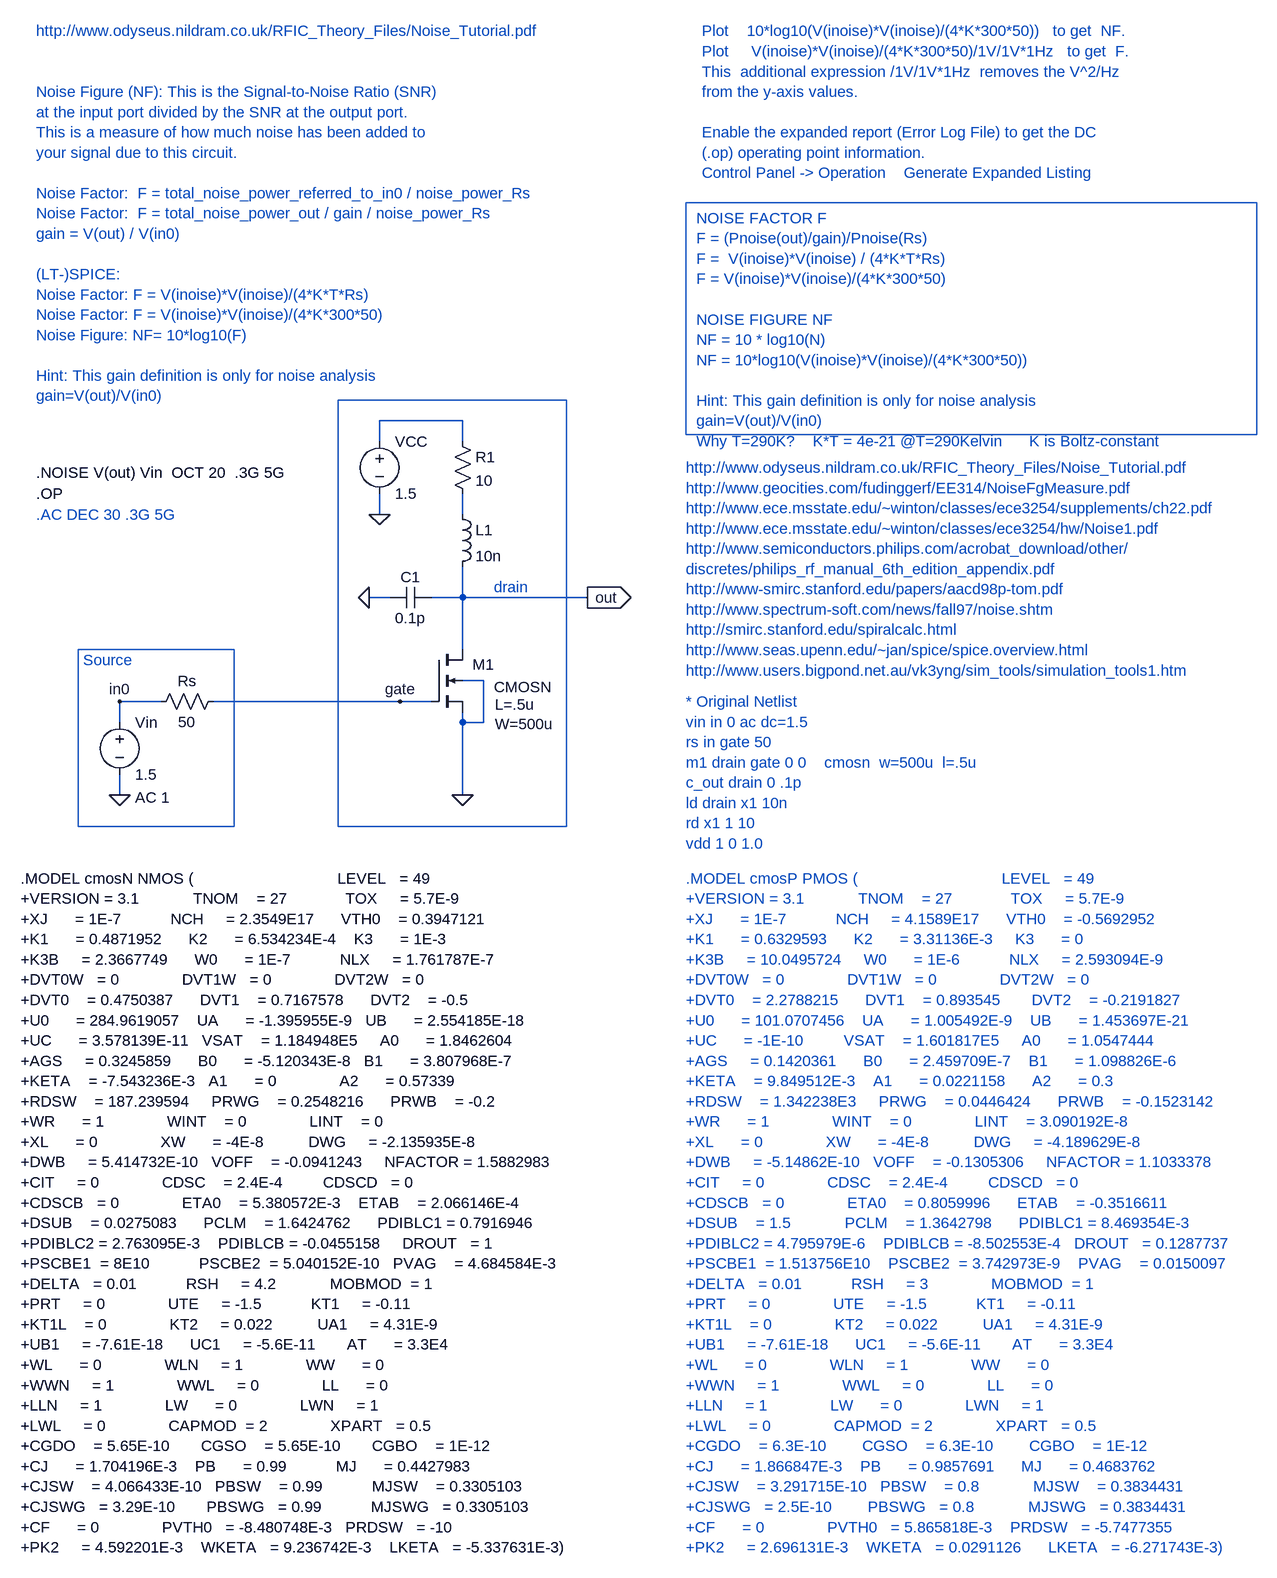
[diagram p0: schematic noise_figure1.asc]
noise_figure1.asc, the LTspice schematic file:
Version 4
SHEET 1 3772 1588
WIRE 208 400 208 368
WIRE 208 512 208 480
WIRE 272 368 208 368
WIRE 608 -32 608 -64
WIRE 608 80 608 48
WIRE 624 208 592 208
WIRE 640 368 352 368
WIRE 688 368 640 368
WIRE 736 -64 608 -64
WIRE 736 -32 736 -64
WIRE 736 80 736 48
WIRE 736 208 688 208
WIRE 736 208 736 160
WIRE 736 288 736 208
WIRE 736 400 736 384
WIRE 736 512 736 400
WIRE 768 336 736 336
WIRE 768 400 736 400
WIRE 768 400 768 336
WIRE 928 208 736 208
FLAG 736 512 0
FLAG 208 512 0
FLAG 608 80 0
FLAG 928 208 out
IOPIN 928 208 Out
FLAG 208 368 in0
FLAG 640 368 gate
FLAG 592 208 0
SYMBOL nmos4 688 288 R0
WINDOW 0 63 23 Left 0
WINDOW 3 96 58 Left 0
WINDOW 123 98 85 Left 0
WINDOW 39 98 115 Left 0
SYMATTR InstName M1
SYMATTR Value CMOSN
SYMATTR Value2 L=.5u
SYMATTR SpiceLine W=500u
SYMBOL res 720 -48 R0
SYMATTR InstName R1
SYMATTR Value 10
SYMBOL voltage 608 -48 R0
SYMATTR InstName VCC
SYMATTR Value 1.5
SYMBOL voltage 208 384 R0
WINDOW 123 24 132 Left 0
WINDOW 39 0 0 Left 0
SYMATTR Value2 AC 1
SYMATTR InstName Vin
SYMATTR Value 1.5
SYMBOL res 256 384 R270
WINDOW 0 32 56 VTop 0
WINDOW 3 0 56 VBottom 0
SYMATTR InstName Rs
SYMATTR Value 50
SYMBOL ind 720 64 R0
SYMATTR InstName L1
SYMATTR Value 10n
SYMBOL cap 624 224 R270
WINDOW 0 32 32 VTop 0
WINDOW 3 0 32 VBottom 0
SYMATTR InstName C1
SYMATTR Value 0.1p
TEXT 56 640 Left 0 !.MODEL cmosN NMOS (                                LEVEL   = 49\n+VERSION = 3.1            TNOM    = 27             TOX     = 5.7E-9\n+XJ      = 1E-7           NCH     = 2.3549E17      VTH0    = 0.3947121\n+K1      = 0.4871952      K2      = 6.534234E-4    K3      = 1E-3\n+K3B     = 2.3667749      W0      = 1E-7           NLX     = 1.761787E-7\n+DVT0W   = 0              DVT1W   = 0              DVT2W   = 0\n+DVT0    = 0.4750387      DVT1    = 0.7167578      DVT2    = -0.5\n+U0      = 284.9619057    UA      = -1.395955E-9   UB      = 2.554185E-18\n+UC      = 3.578139E-11   VSAT    = 1.184948E5     A0      = 1.8462604\n+AGS     = 0.3245859      B0      = -5.120343E-8   B1      = 3.807968E-7\n+KETA    = -7.543236E-3   A1      = 0              A2      = 0.57339\n+RDSW    = 187.239594     PRWG    = 0.2548216      PRWB    = -0.2\n+WR      = 1              WINT    = 0              LINT    = 0\n+XL      = 0              XW      = -4E-8          DWG     = -2.135935E-8\n+DWB     = 5.414732E-10   VOFF    = -0.0941243     NFACTOR = 1.5882983\n+CIT     = 0              CDSC    = 2.4E-4         CDSCD   = 0\n+CDSCB   = 0              ETA0    = 5.380572E-3    ETAB    = 2.066146E-4\n+DSUB    = 0.0275083      PCLM    = 1.6424762      PDIBLC1 = 0.7916946\n+PDIBLC2 = 2.763095E-3    PDIBLCB = -0.0455158     DROUT   = 1\n+PSCBE1  = 8E10           PSCBE2  = 5.040152E-10   PVAG    = 4.684584E-3\n+DELTA   = 0.01           RSH     = 4.2            MOBMOD  = 1\n+PRT     = 0              UTE     = -1.5           KT1     = -0.11\n+KT1L    = 0              KT2     = 0.022          UA1     = 4.31E-9\n+UB1     = -7.61E-18      UC1     = -5.6E-11       AT      = 3.3E4\n+WL      = 0              WLN     = 1              WW      = 0\n+WWN     = 1              WWL     = 0              LL      = 0\n+LLN     = 1              LW      = 0              LWN     = 1\n+LWL     = 0              CAPMOD  = 2              XPART   = 0.5\n+CGDO    = 5.65E-10       CGSO    = 5.65E-10       CGBO    = 1E-12\n+CJ      = 1.704196E-3    PB      = 0.99           MJ      = 0.4427983\n+CJSW    = 4.066433E-10   PBSW    = 0.99           MJSW    = 0.3305103\n+CJSWG   = 3.29E-10       PBSWG   = 0.99           MJSWG   = 0.3305103\n+CF      = 0              PVTH0   = -8.480748E-3   PRDSW   = -10\n+PK2     = 4.592201E-3    WKETA   = 9.236742E-3    LKETA   = -5.337631E-3)
TEXT 80 16 Left 0 !.NOISE V(out) Vin  OCT 20  .3G 5G
TEXT 1080 640 Left 0 ;.MODEL cmosP PMOS (                                LEVEL   = 49\n+VERSION = 3.1            TNOM    = 27             TOX     = 5.7E-9\n+XJ      = 1E-7           NCH     = 4.1589E17      VTH0    = -0.5692952\n+K1      = 0.6329593      K2      = 3.31136E-3     K3      = 0\n+K3B     = 10.0495724     W0      = 1E-6           NLX     = 2.593094E-9\n+DVT0W   = 0              DVT1W   = 0              DVT2W   = 0\n+DVT0    = 2.2788215      DVT1    = 0.893545       DVT2    = -0.2191827\n+U0      = 101.0707456    UA      = 1.005492E-9    UB      = 1.453697E-21\n+UC      = -1E-10         VSAT    = 1.601817E5     A0      = 1.0547444\n+AGS     = 0.1420361      B0      = 2.459709E-7    B1      = 1.098826E-6\n+KETA    = 9.849512E-3    A1      = 0.0221158      A2      = 0.3\n+RDSW    = 1.342238E3     PRWG    = 0.0446424      PRWB    = -0.1523142\n+WR      = 1              WINT    = 0              LINT    = 3.090192E-8\n+XL      = 0              XW      = -4E-8          DWG     = -4.189629E-8\n+DWB     = -5.14862E-10   VOFF    = -0.1305306     NFACTOR = 1.1033378\n+CIT     = 0              CDSC    = 2.4E-4         CDSCD   = 0\n+CDSCB   = 0              ETA0    = 0.8059996      ETAB    = -0.3516611\n+DSUB    = 1.5            PCLM    = 1.3642798      PDIBLC1 = 8.469354E-3\n+PDIBLC2 = 4.795979E-6    PDIBLCB = -8.502553E-4   DROUT   = 0.1287737\n+PSCBE1  = 1.513756E10    PSCBE2  = 3.742973E-9    PVAG    = 0.0150097\n+DELTA   = 0.01           RSH     = 3              MOBMOD  = 1\n+PRT     = 0              UTE     = -1.5           KT1     = -0.11\n+KT1L    = 0              KT2     = 0.022          UA1     = 4.31E-9\n+UB1     = -7.61E-18      UC1     = -5.6E-11       AT      = 3.3E4\n+WL      = 0              WLN     = 1              WW      = 0\n+WWN     = 1              WWL     = 0              LL      = 0\n+LLN     = 1              LW      = 0              LWN     = 1\n+LWL     = 0              CAPMOD  = 2              XPART   = 0.5\n+CGDO    = 6.3E-10        CGSO    = 6.3E-10        CGBO    = 1E-12\n+CJ      = 1.866847E-3    PB      = 0.9857691      MJ      = 0.4683762\n+CJSW    = 3.291715E-10   PBSW    = 0.8            MJSW    = 0.3834431\n+CJSWG   = 2.5E-10        PBSWG   = 0.8            MJSWG   = 0.3834431\n+CF      = 0              PVTH0   = 5.865818E-3    PRDSW   = -5.7477355\n+PK2     = 2.696131E-3    WKETA   = 0.0291126      LKETA   = -6.271743E-3)
TEXT 80 -664 Left 0 ;http://www.odyseus.nildram.co.uk/RFIC_Theory_Files/Noise_Tutorial.pdf\n \n \nNoise Figure (NF): This is the Signal-to-Noise Ratio (SNR)\nat the input port divided by the SNR at the output port.  \nThis is a measure of how much noise has been added to\nyour signal due to this circuit.  \n \nNoise Factor:  F = total_noise_power_referred_to_in0 / noise_power_Rs\nNoise Factor:  F = total_noise_power_out / gain / noise_power_Rs\ngain = V(out) / V(in0)\n \n(LT-)SPICE: \nNoise Factor: F = V(inoise)*V(inoise)/(4*K*T*Rs)\nNoise Factor: F = V(inoise)*V(inoise)/(4*K*300*50)\nNoise Figure: NF= 10*log10(F)\n \nHint: This gain definition is only for noise analysis\ngain=V(out)/V(in0)
TEXT 1080 8 Left 0 ;http://www.odyseus.nildram.co.uk/RFIC_Theory_Files/Noise_Tutorial.pdf\nhttp://www.geocities.com/fudinggerf/EE314/NoiseFgMeasure.pdf\nhttp://www.ece.msstate.edu/~winton/classes/ece3254/supplements/ch22.pdf\nhttp://www.ece.msstate.edu/~winton/classes/ece3254/hw/Noise1.pdf\nhttp://www.semiconductors.philips.com/acrobat_download/other/\ndiscretes/philips_rf_manual_6th_edition_appendix.pdf\nhttp://www-smirc.stanford.edu/papers/aacd98p-tom.pdf\nhttp://www.spectrum-soft.com/news/fall97/noise.shtm\nhttp://smirc.stanford.edu/spiralcalc.html\nhttp://www.seas.upenn.edu/~jan/spice/spice.overview.html\nhttp://www.users.bigpond.net.au/vk3yng/sim_tools/simulation_tools1.htm
TEXT 1080 368 Left 0 ;* Original Netlist\nvin in 0 ac dc=1.5\nrs in gate 50\nm1 drain gate 0 0    cmosn  w=500u  l=.5u\nc_out drain 0 .1p\nld drain x1 10n\nrd x1 1 10\nvdd 1 0 1.0
TEXT 80 80 Left 0 ;.AC DEC 30 .3G 5G
TEXT 152 304 Left 0 ;Source
TEXT 784 192 Left 0 ;drain
TEXT 1096 -376 Left 0 ;NOISE FACTOR F\nF = (Pnoise(out)/gain)/Pnoise(Rs) \nF =  V(inoise)*V(inoise) / (4*K*T*Rs)\nF = V(inoise)*V(inoise)/(4*K*300*50)\n \nNOISE FIGURE NF\nNF = 10 * log10(N)\nNF = 10*log10(V(inoise)*V(inoise)/(4*K*300*50))\n  \nHint: This gain definition is only for noise analysis\ngain=V(out)/V(in0)\nWhy T=290K?    K*T = 4e-21 @T=290Kelvin      K is Boltz-constant
TEXT 1104 -664 Left 0 ;Plot    10*log10(V(inoise)*V(inoise)/(4*K*300*50))   to get  NF.\nPlot     V(inoise)*V(inoise)/(4*K*300*50)/1V/1V*1Hz   to get  F.\nThis  additional expression /1V/1V*1Hz  removes the V^2/Hz \nfrom the y-axis values.\n \nEnable the expanded report (Error Log File) to get the DC \n(.op) operating point information.\nControl Panel -> Operation    Generate Expanded Listing
TEXT 80 48 Left 0 !.OP
RECTANGLE Normal 144 560 384 288
RECTANGLE Normal 1958 -43 1080 -400
RECTANGLE Normal 896 560 544 -96

The netlist it stands for:
* noise_figure1.asc
M1 out gate 0 0 CMOSN L=.5u W=500u
R1 N001 N002 10
VCC N001 0 1.5
Vin in0 0 1.5 AC 1
Rs in0 gate 50
L1 N002 out 10n
C1 0 out 0.1p
.model NMOS NMOS
.model PMOS PMOS
.lib standard.mos
.MODEL cmosN NMOS (                                LEVEL   = 49
+VERSION = 3.1            TNOM    = 27             TOX     = 5.7E-9
+XJ      = 1E-7           NCH     = 2.3549E17      VTH0    = 0.3947121
+K1      = 0.4871952      K2      = 6.534234E-4    K3      = 1E-3
+K3B     = 2.3667749      W0      = 1E-7           NLX     = 1.761787E-7
+DVT0W   = 0              DVT1W   = 0              DVT2W   = 0
+DVT0    = 0.4750387      DVT1    = 0.7167578      DVT2    = -0.5
+U0      = 284.9619057    UA      = -1.395955E-9   UB      = 2.554185E-18
+UC      = 3.578139E-11   VSAT    = 1.184948E5     A0      = 1.8462604
+AGS     = 0.3245859      B0      = -5.120343E-8   B1      = 3.807968E-7
+KETA    = -7.543236E-3   A1      = 0              A2      = 0.57339
+RDSW    = 187.239594     PRWG    = 0.2548216      PRWB    = -0.2
+WR      = 1              WINT    = 0              LINT    = 0
+XL      = 0              XW      = -4E-8          DWG     = -2.135935E-8
+DWB     = 5.414732E-10   VOFF    = -0.0941243     NFACTOR = 1.5882983
+CIT     = 0              CDSC    = 2.4E-4         CDSCD   = 0
+CDSCB   = 0              ETA0    = 5.380572E-3    ETAB    = 2.066146E-4
+DSUB    = 0.0275083      PCLM    = 1.6424762      PDIBLC1 = 0.7916946
+PDIBLC2 = 2.763095E-3    PDIBLCB = -0.0455158     DROUT   = 1
+PSCBE1  = 8E10           PSCBE2  = 5.040152E-10   PVAG    = 4.684584E-3
+DELTA   = 0.01           RSH     = 4.2            MOBMOD  = 1
+PRT     = 0              UTE     = -1.5           KT1     = -0.11
+KT1L    = 0              KT2     = 0.022          UA1     = 4.31E-9
+UB1     = -7.61E-18      UC1     = -5.6E-11       AT      = 3.3E4
+WL      = 0              WLN     = 1              WW      = 0
+WWN     = 1              WWL     = 0              LL      = 0
+LLN     = 1              LW      = 0              LWN     = 1
+LWL     = 0              CAPMOD  = 2              XPART   = 0.5
+CGDO    = 5.65E-10       CGSO    = 5.65E-10       CGBO    = 1E-12
+CJ      = 1.704196E-3    PB      = 0.99           MJ      = 0.4427983
+CJSW    = 4.066433E-10   PBSW    = 0.99           MJSW    = 0.3305103
+CJSWG   = 3.29E-10       PBSWG   = 0.99           MJSWG   = 0.3305103
+CF      = 0              PVTH0   = -8.480748E-3   PRDSW   = -10
+PK2     = 4.592201E-3    WKETA   = 9.236742E-3    LKETA   = -5.337631E-3)
.NOISE V(out) Vin  OCT 20  .3G 5G
* .MODEL cmosP PMOS (                                LEVEL   = 49
* +VERSION = 3.1            TNOM    = 27             TOX     = 5.7E-9
* +XJ      = 1E-7           NCH     = 4.1589E17      VTH0    = -0.5692952
* +K1      = 0.6329593      K2      = 3.31136E-3     K3      = 0
* +K3B     = 10.0495724     W0      = 1E-6           NLX     = 2.593094E-9
* +DVT0W   = 0              DVT1W   = 0              DVT2W   = 0
* +DVT0    = 2.2788215      DVT1    = 0.893545       DVT2    = -0.2191827
* +U0      = 101.0707456    UA      = 1.005492E-9    UB      = 1.453697E-21
* +UC      = -1E-10         VSAT    = 1.601817E5     A0      = 1.0547444
* +AGS     = 0.1420361      B0      = 2.459709E-7    B1      = 1.098826E-6
* +KETA    = 9.849512E-3    A1      = 0.0221158      A2      = 0.3
* +RDSW    = 1.342238E3     PRWG    = 0.0446424      PRWB    = -0.1523142
* +WR      = 1              WINT    = 0              LINT    = 3.090192E-8
* +XL      = 0              XW      = -4E-8          DWG     = -4.189629E-8
* +DWB     = -5.14862E-10   VOFF    = -0.1305306     NFACTOR = 1.1033378
* +CIT     = 0              CDSC    = 2.4E-4         CDSCD   = 0
* +CDSCB   = 0              ETA0    = 0.8059996      ETAB    = -0.3516611
* +DSUB    = 1.5            PCLM    = 1.3642798      PDIBLC1 = 8.469354E-3
* +PDIBLC2 = 4.795979E-6    PDIBLCB = -8.502553E-4   DROUT   = 0.1287737
* +PSCBE1  = 1.513756E10    PSCBE2  = 3.742973E-9    PVAG    = 0.0150097
* +DELTA   = 0.01           RSH     = 3              MOBMOD  = 1
* +PRT     = 0              UTE     = -1.5           KT1     = -0.11
* +KT1L    = 0              KT2     = 0.022          UA1     = 4.31E-9
* +UB1     = -7.61E-18      UC1     = -5.6E-11       AT      = 3.3E4
* +WL      = 0              WLN     = 1              WW      = 0
* +WWN     = 1              WWL     = 0              LL      = 0
* +LLN     = 1              LW      = 0              LWN     = 1
* +LWL     = 0              CAPMOD  = 2              XPART   = 0.5
* +CGDO    = 6.3E-10        CGSO    = 6.3E-10        CGBO    = 1E-12
* +CJ      = 1.866847E-3    PB      = 0.9857691      MJ      = 0.4683762
* +CJSW    = 3.291715E-10   PBSW    = 0.8            MJSW    = 0.3834431
* +CJSWG   = 2.5E-10        PBSWG   = 0.8            MJSWG   = 0.3834431
* +CF      = 0              PVTH0   = 5.865818E-3    PRDSW   = -5.7477355
* +PK2     = 2.696131E-3    WKETA   = 0.0291126      LKETA   = -6.271743E-3)
* http://www.odyseus.nildram.co.uk/RFIC_Theory_Files/Noise_Tutorial.pdf
* Noise Figure (NF): This is the Signal-to-Noise Ratio (SNR)
* at the input port divided by the SNR at the output port.
* This is a measure of how much noise has been added to
* your signal due to this circuit.
* Noise Factor:  F = total_noise_power_referred_to_in0 / noise_power_Rs
* Noise Factor:  F = total_noise_power_out / gain / noise_power_Rs
* gain = V(out) / V(in0)
* (LT-)SPICE:
* Noise Factor: F = V(inoise)*V(inoise)/(4*K*T*Rs)
* Noise Factor: F = V(inoise)*V(inoise)/(4*K*300*50)
* Noise Figure: NF= 10*log10(F)
* Hint: This gain definition is only for noise analysis
* gain=V(out)/V(in0)
* http://www.odyseus.nildram.co.uk/RFIC_Theory_Files/Noise_Tutorial.pdf
* http://www.geocities.com/fudinggerf/EE314/NoiseFgMeasure.pdf
* http://www.ece.msstate.edu/~winton/classes/ece3254/supplements/ch22.pdf
* http://www.ece.msstate.edu/~winton/classes/ece3254/hw/Noise1.pdf
* http://www.semiconductors.philips.com/acrobat_download/other/
* discretes/philips_rf_manual_6th_edition_appendix.pdf
* http://www-smirc.stanford.edu/papers/aacd98p-tom.pdf
* http://www.spectrum-soft.com/news/fall97/noise.shtm
* http://smirc.stanford.edu/spiralcalc.html
* http://www.seas.upenn.edu/~jan/spice/spice.overview.html
* http://www.users.bigpond.net.au/vk3yng/sim_tools/simulation_tools1.htm
* * Original Netlist
* vin in 0 ac dc=1.5
* rs in gate 50
* m1 drain gate 0 0    cmosn  w=500u  l=.5u
* c_out drain 0 .1p
* ld drain x1 10n
* rd x1 1 10
* vdd 1 0 1.0
* .AC DEC 30 .3G 5G
* Source
* drain
* NOISE FACTOR F
* F = (Pnoise(out)/gain)/Pnoise(Rs)
* F =  V(inoise)*V(inoise) / (4*K*T*Rs)
* F = V(inoise)*V(inoise)/(4*K*300*50)
* NOISE FIGURE NF
* NF = 10 * log10(N)
* NF = 10*log10(V(inoise)*V(inoise)/(4*K*300*50))
* Hint: This gain definition is only for noise analysis
* gain=V(out)/V(in0)
* Why T=290K?    K*T = 4e-21 @T=290Kelvin      K is Boltz-constant
* Plot    10*log10(V(inoise)*V(inoise)/(4*K*300*50))   to get  NF.
* Plot     V(inoise)*V(inoise)/(4*K*300*50)/1V/1V*1Hz   to get  F.
* This  additional expression /1V/1V*1Hz  removes the V^2/Hz
* from the y-axis values.
* Enable the expanded report (Error Log File) to get the DC
* (.op) operating point information.
* Control Panel -> Operation    Generate Expanded Listing
.OP
.backanno
.end